# EasyEDA Pro project 外部.eprj

# Schematic Schematic1
Create Date: 2024-06-12; Page Name: P1; Project Name: 外部; Schematic Name: Schematic1; Update Date: 2024-06-14; Company: 嘉立创EDA; Page Size: A4; Version: V1.0
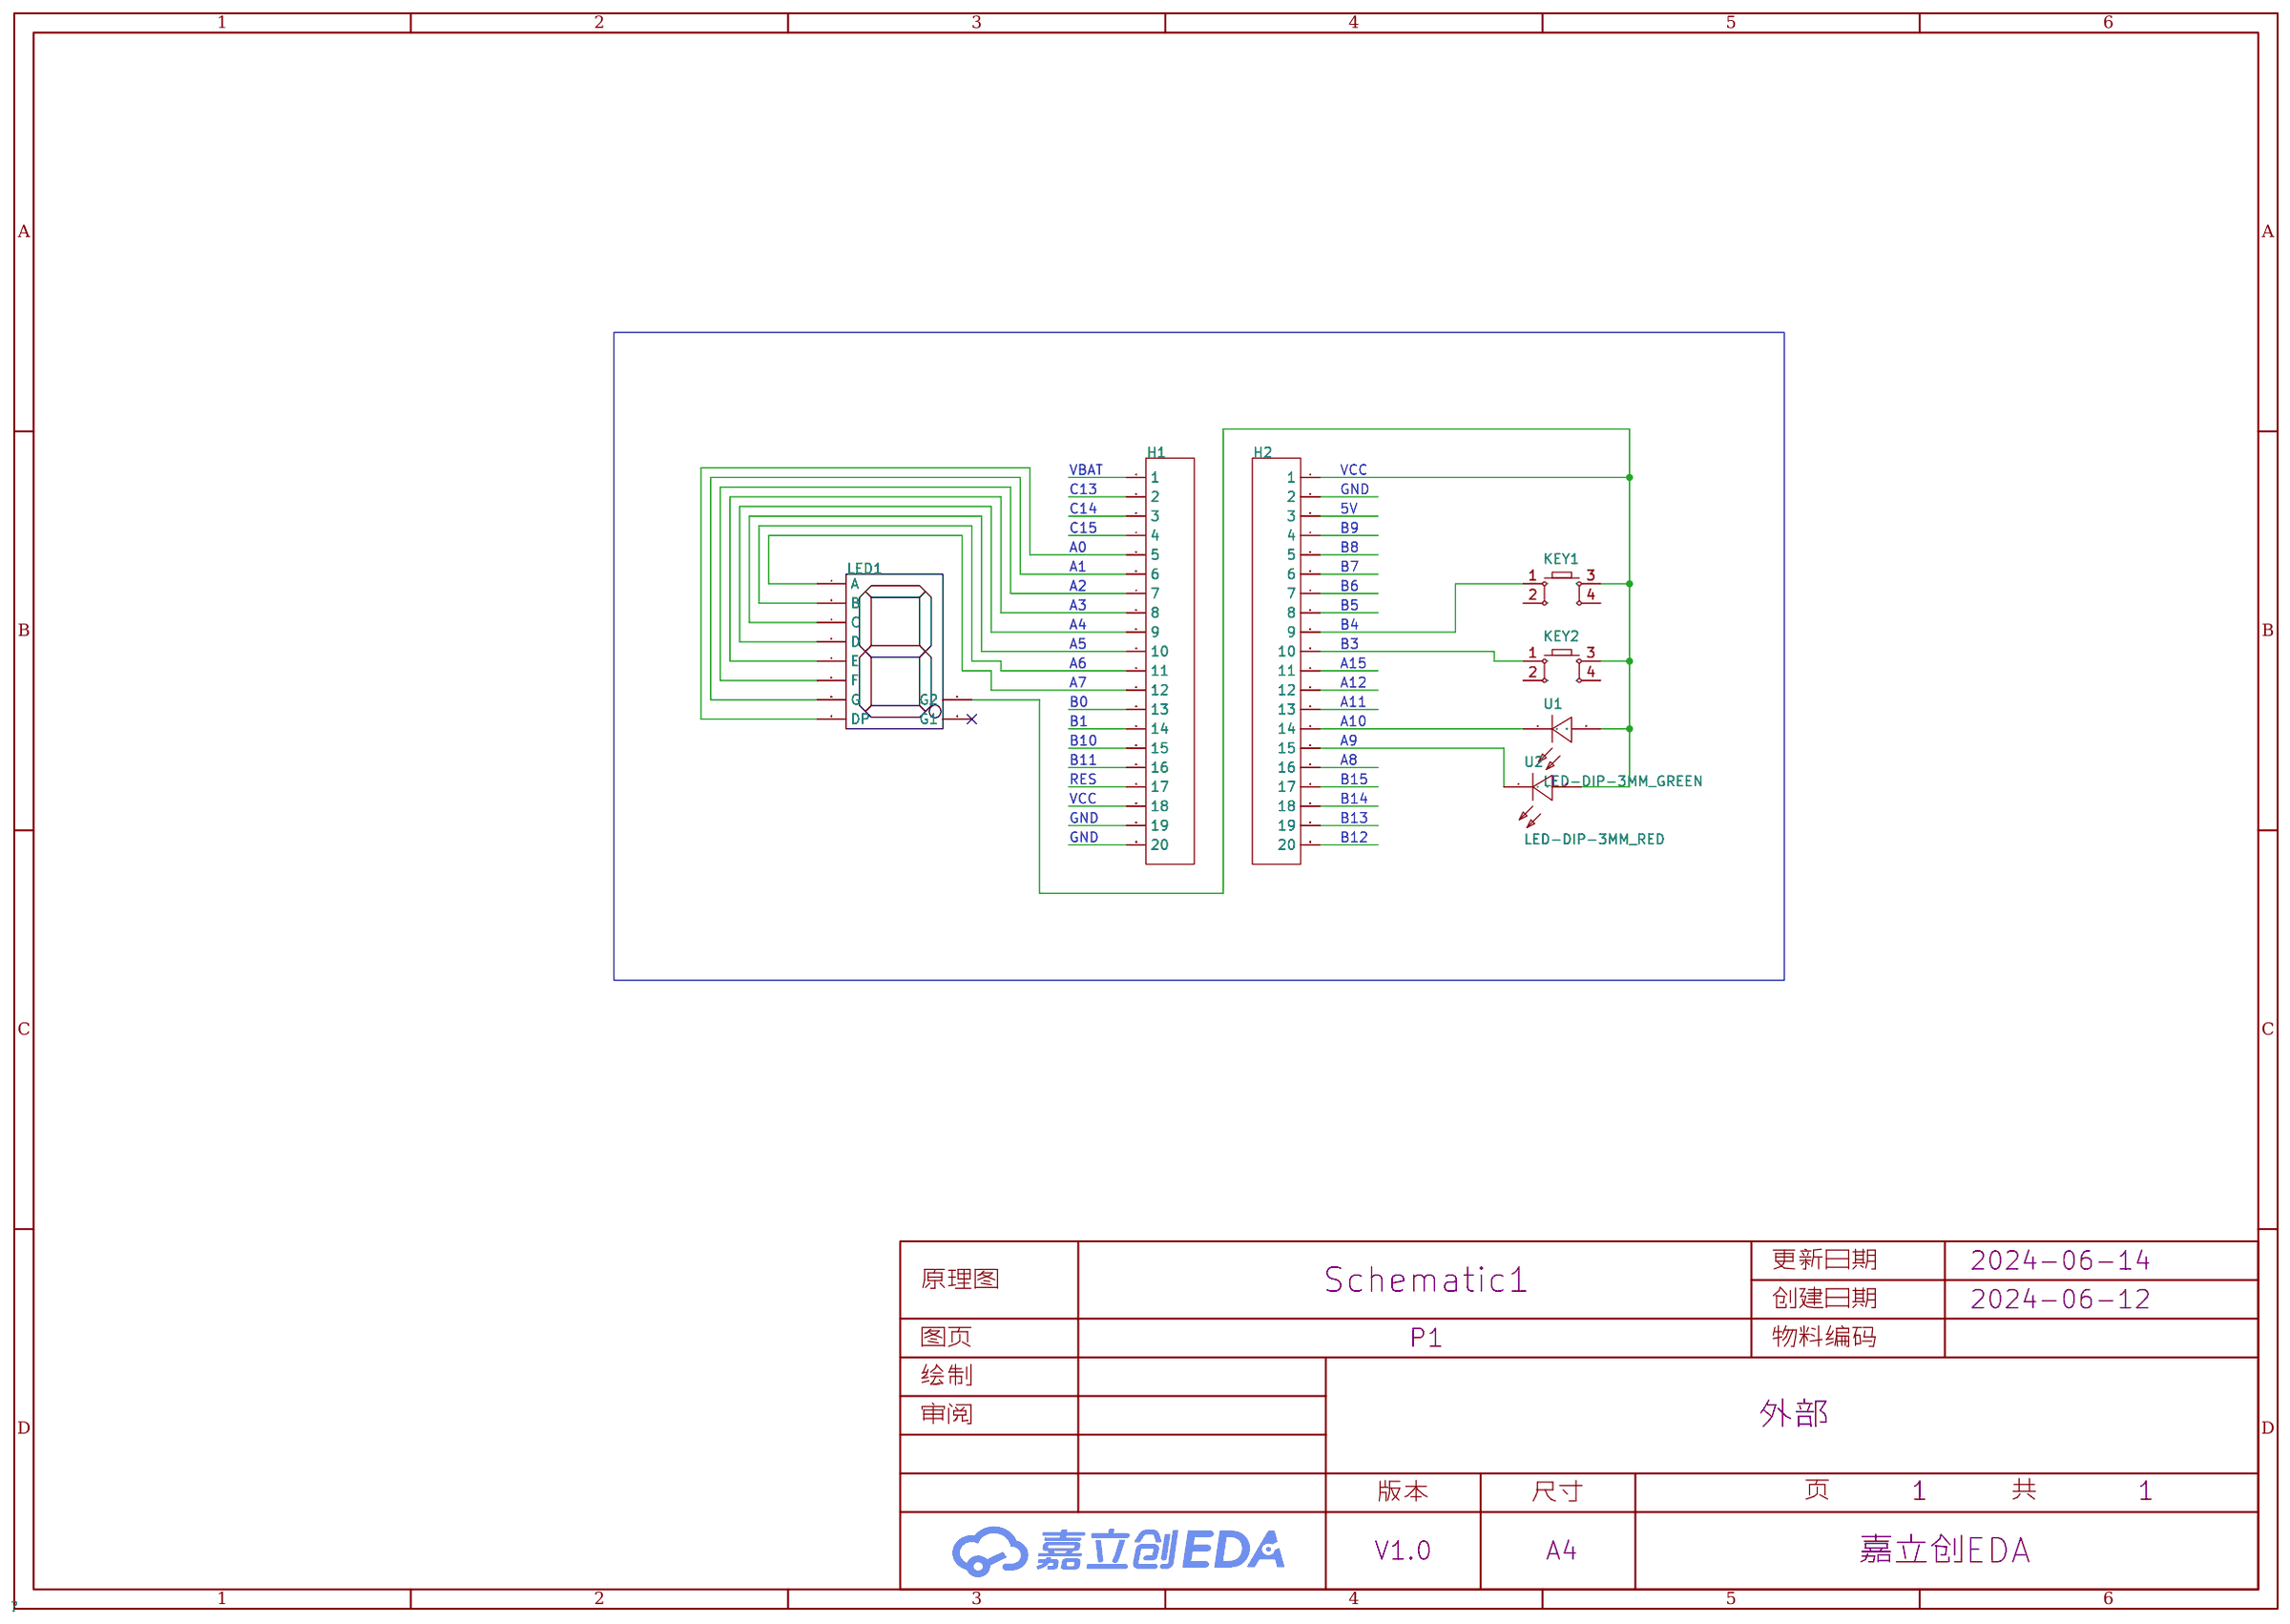
[diagram p0: schematic sheet]

## Parts
H1  -  [HDR-TH_20P-P2.54-V-F]
H2  -  [HDR-TH_20P-P2.54-V-F]
KEY1  -  [Key_SMD_12x12x7.3]
KEY2  -  [Key_SMD_12x12x7.3]
LED1  -  [LED-SEG-TH_10P-L12.6-W19.0-P2.54-S15.24-BL]
U1  LED-DIP-3MM_GREEN  [LED-TH_BD4.0-P2.00-D0.5-RD_BULE]
U2  LED-DIP-3MM_RED  [LED-TH_BD4.0-P2.00-D0.5-RD_BULE]

## Library data of the parts
H1 H2 = HDR-F_2.54_1x20P: Supplier Part: C50984; Supplier Footprint: 插件
KEY1 KEY2 = Key_SMD_12x12x7.3: Supplier Footprint: SMD
LED1 = LED_SEG_TH_0.56x1: Supplier Footprint: 插件
U1 U2 = LED-DIP-3MM_Blue: Supplier Part: C9900002363; Supplier Footprint: LED-TH_BD4.1-P2.00; JLCPCB Part Class: 扩展库; Supplier: LCSC

## Nets
$1N320: H1.6 LED1.10(G)
$1N324: H1.7 LED1.9(F)
$1N328: H1.8 LED1.1(E)
$1N332: H1.9 LED1.2(D)
$1N336: H1.10 LED1.4(C)
$1N340: H1.11 LED1.6(B)
$1N344: H1.12 LED1.7(A)
$1N418: H2.10 KEY2.1
$1N434: H2.14 U1.1
$1N438: H2.15 U2.1
$1N1407: H1.5 LED1.5(DP)
$1N1926: H2.9 KEY1.1
$1N2233: H2.1 KEY1.3 KEY2.3 LED1.8(G2) U1.2 U2.2

Not connected (* = marked no-connect by the designer): H1 1 2 3 4 13 14 15 16 17 18 19 20; H2 2 3 4 5 6 7 8 11 12 13 16 17 18 19 20; KEY1 2 4; KEY2 2 4; LED1 3(G1)*

## Notes on the sheet
- VBAT
- VCC
- C13
- GND
- C14
- 5V
- C15
- B9
- A0
- B8
- A1
- A2
- B6
- B7
- A3
- B5
- A4
- B4
- A5
- B3
- A6
- A15
- A7
- B0
- A11
- A12
- B1
- A10
- B10
- A9
- B11
- A8
- RES
- B15
- VCC
- B14
- GND
- GND
- B12
- B13

# Board PCB1
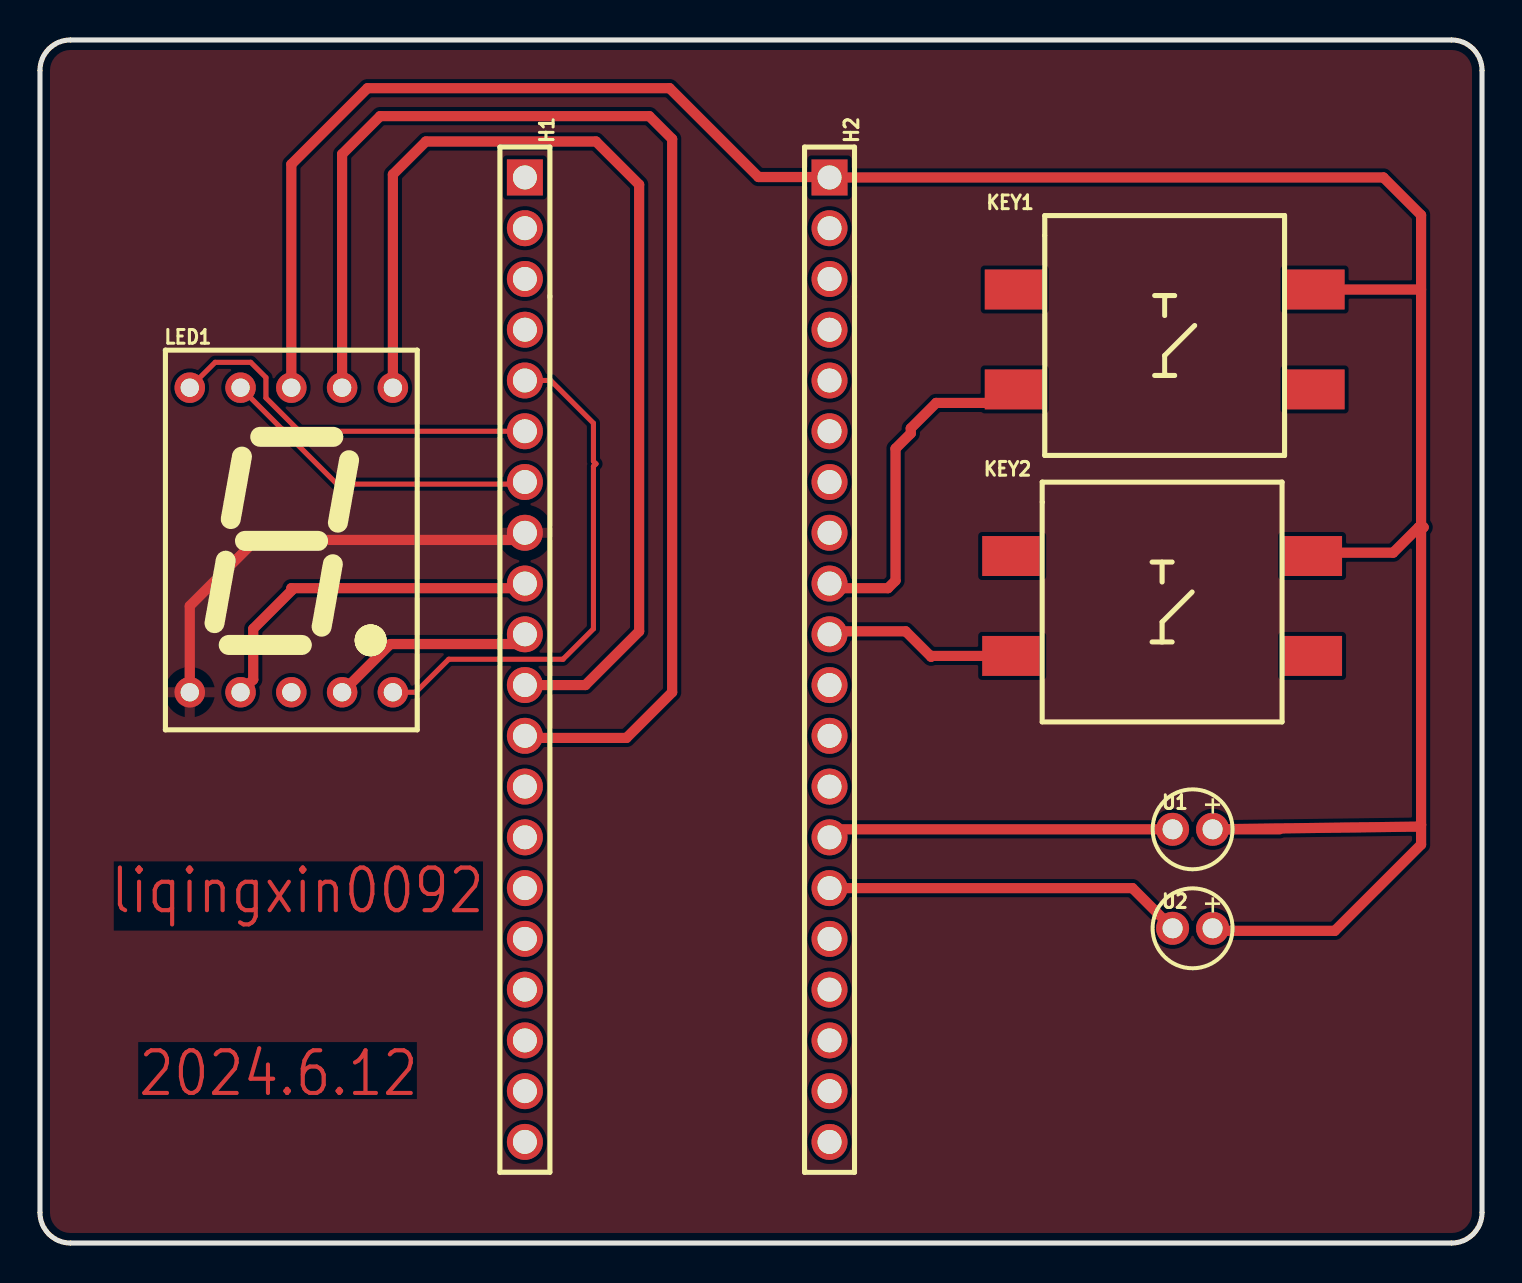
[diagram p1: board, top side]
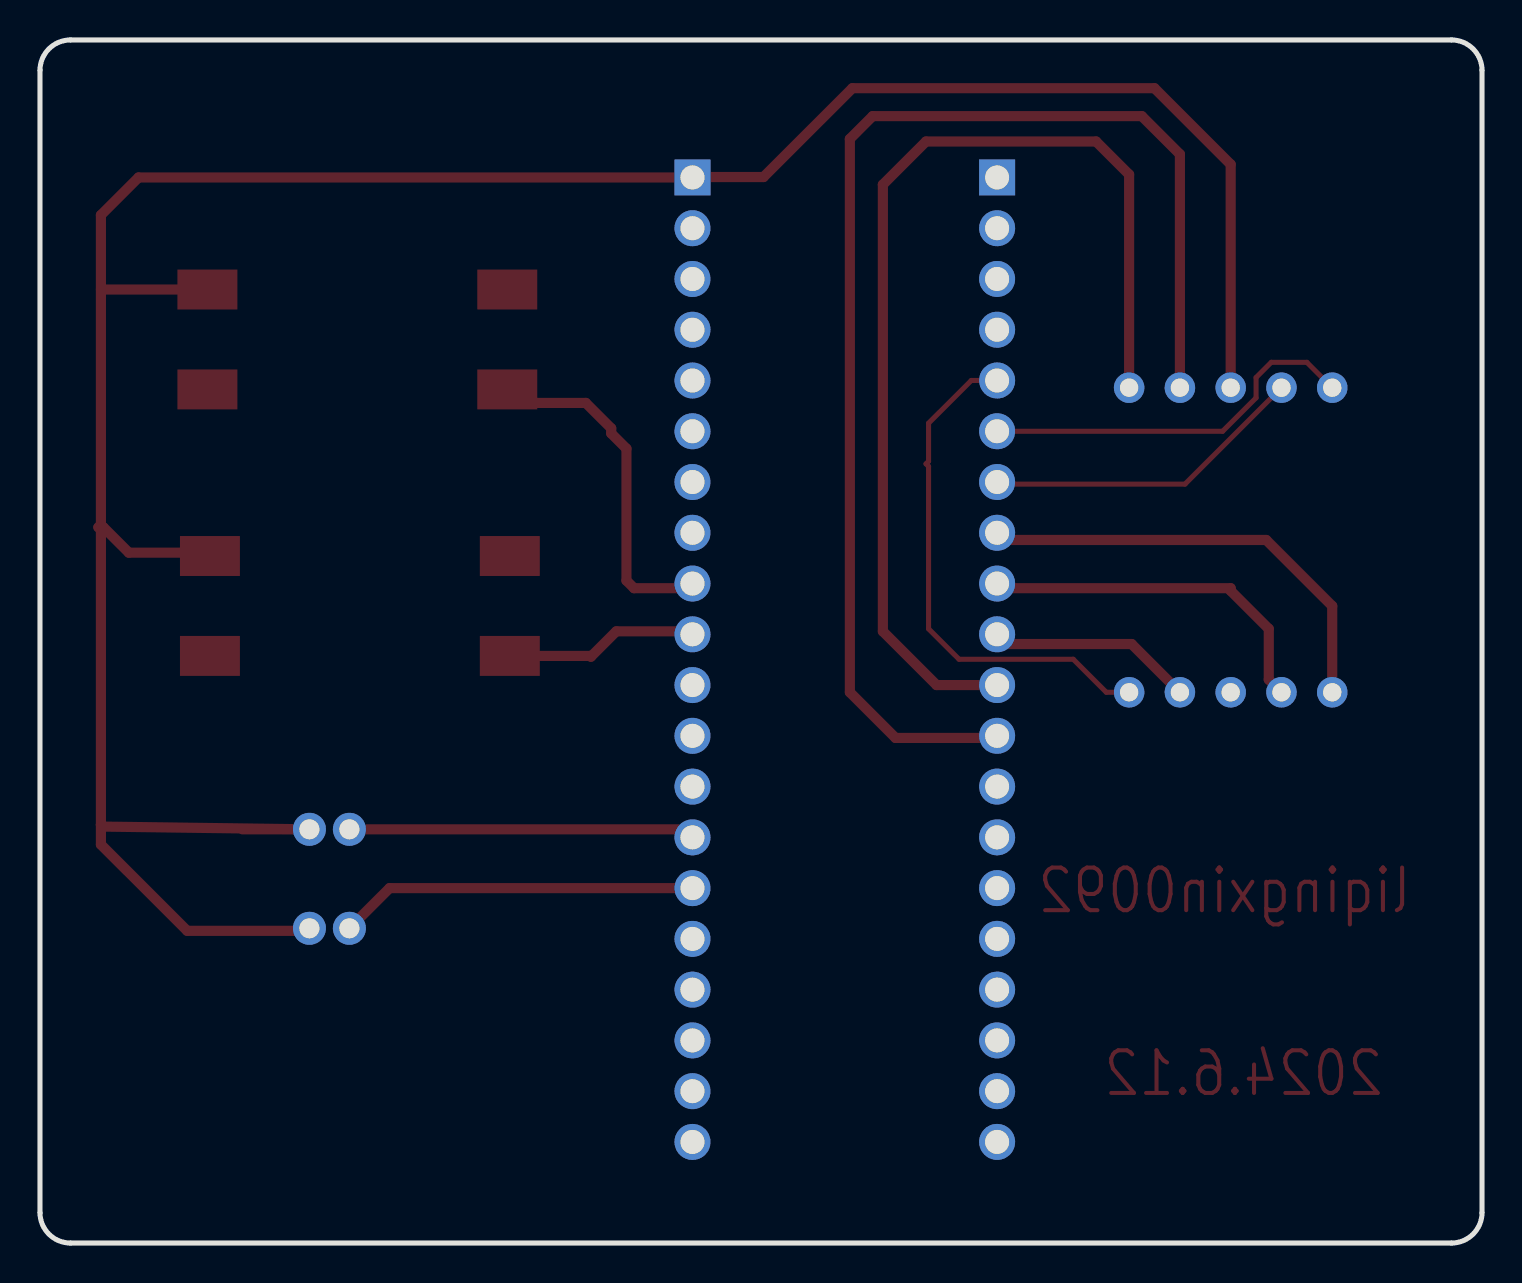
[diagram p2: board, bottom side, seen from below]

Outline 72.14 x 60.2 mm; copper layers: Top Layer, Bottom Layer. Coordinates in mm from the lower left corner of the outline.
Outline path: 0,58.67 0,1.52 arc(0.45,0.45) 1.52,0 70.61,0 arc(71.69,0.45) 72.14,1.52 72.14,58.67 arc(71.69,59.75) 70.61,60.2 1.52,60.2 arc(0.45,59.75) 0,58.67
Stack: Top Layer 0.035mm / Dielectric1 1.51mm FR4 er 4.5 / Bottom Layer 0.035mm

## Design rules (mm)
template: JLCPCB Capability(Two Layers Board)
spacing copperThickness1oz (default): track to track 0.102, other pairs 0.152 to 0.3
spacing copperThickness2oz: track to track 0.203, other pairs 0.152 to 0.3
track width copperThickness1oz (default): min 0.127, default 0.254, max 2.54
track width copperThickness2oz: min 0.203, default 0.254, max 2.54
differential pair differentialPair (default): width min 0.127, default 0.254, max 2.54; gap min 0.152, default 0.152
via viaSize (default): diameter min 0.5, default 0.61, max 10; hole min 0.3, default 0.305, max 6.3

## Placement (name value [footprint] x y rotation side)
H1  -  [HDR-TH_20P-P2.54-V-F]  24.26 29.19 270 top
H2  -  [HDR-TH_20P-P2.54-V-F]  39.5 29.19 270 top
KEY1  -  [Key_SMD_12x12x7.3]  56.26 45.21 0 top
KEY2  -  [Key_SMD_12x12x7.3]  56.13 31.88 0 top
LED1  -  [LED-SEG-TH_10P-L12.6-W19.0-P2.54-S15.24-BL]  12.57 35.18 0 top
U1  LED-DIP-3MM_GREEN  [LED-TH_BD4.0-P2.00-D0.5-RD_BULE]  57.66 20.7 0 top
U2  LED-DIP-3MM_RED  [LED-TH_BD4.0-P2.00-D0.5-RD_BULE]  57.66 15.75 0 top

## Footprints (pads in the part's own frame, mm; a bottom-side part is the same pattern mirrored in y, then rotated)
HDR-TH_20P-P2.54-V-F
  rect 1.8x1.8 hole 1.2: 1(-24.13,0)
  round 1.8 hole 1.2: 2(-21.59,0) 3(-19.05,0) 4(-16.51,0) 5(-13.97,0) 6(-11.43,0) 7(-8.89,0) 8(-6.35,0) 9(-3.81,0) 10(-1.27,0) 11(1.27,0) 12(3.81,0) 13(6.35,0) 14(8.89,0) 15(11.43,0) 16(13.97,0) 17(16.51,0) 18(19.05,0) 19(21.59,0) 20(24.13,0)
Key_SMD_12x12x7.3
  rect 2.999x1.999 smd: 1(-7.5,-2.499) 2(7.5,-2.499) 3(7.5,2.499) 4(-7.5,2.499)
LED-SEG-TH_10P-L12.6-W19.0-P2.54-S15.24-BL
  round 1.524 hole 0.914: 1(-5.08,-7.62) 2(-2.54,-7.62) 3(0,-7.62) 4(2.54,-7.62) 5(5.08,-7.62) 6(5.08,7.62) 7(2.54,7.62) 8(0,7.62) 9(-2.54,7.62) 10(-5.08,7.62)
LED-TH_BD4.0-P2.00-D0.5-RD_BULE
  round 1.65 hole 1: 1(-1,0) 2(1,0)

## Nets
As in the schematic.

Pads without a net: H1 18; KEY1 2 4; KEY2 2 4; LED1 3

## Routing (per net, layer and track width the routed paths; a pad name or vN(x,y) marks a point on that pad's centre or on a via; arc(x,y) is an arc through that point)
$1N320: length 19.3
  Top Layer w0.254: H1.6 12.97,40.62 11.3,42.29 11.3,43.31 10.54,44.07 8.76,44.07 LED1.10
$1N324: length 16.3
  Top Layer w0.254: H1.7 24.15,37.97 14.86,37.97 LED1.9
$1N328: length 22.6
  Top Layer w0.508: H1.8 23.9,35.18 10.8,35.18 7.49,31.88 LED1.1
$1N332: length 18
  Top Layer w0.508: LED1.2 10.67,28.19 10.67,30.73 12.57,32.64 12.57,32.77 24.02,32.77 H1.9
$1N336: length 10.3
  Top Layer w0.508: H1.10 23.77,29.97 17.53,29.97 LED1.4
$1N340: length 53.7
  Top Layer w0.508: H1.11 27.28,27.92 29.97,30.61 29.97,52.96 27.81,55.12 19.3,55.12 17.65,53.47 LED1.6
$1N344: length 65.5
  Top Layer w0.508: H1.12 24.36,25.27 29.34,25.27 31.62,27.56 31.62,55.24 30.48,56.39 17.02,56.39 15.11,54.48 LED1.7
$1N418: length 9.7
  Top Layer w0.508: H2.10 39.64,30.61 43.31,30.61 44.58,29.34 44.62,29.38 KEY2.1
$1N434: length 17.3
  Top Layer w0.508: H2.14 39.9,20.7 U1.1
$1N438: length 18
  Top Layer w0.508: H2.15 54.65,17.76 U2.1
$1N1407: length 26.1
  Top Layer w0.254: H1.5 25.55,43.16 27.69,41.02 27.69,39.12 27.81,38.99 27.69,38.86 27.69,30.73 26.16,29.21 20.45,29.21 18.8,27.56 LED1.5
$1N1926: length 17.5
  Top Layer w0.508: H2.9 39.73,32.77 42.42,32.77 42.8,33.15 42.8,39.75 43.56,40.51 43.56,40.77 44.83,42.04 48.08,42.04 KEY1.1
$1N2233: length 141
  Top Layer w0.508: 69.09,35.81 69.09,20.93 ; 69.09,35.81 69.21,35.81 69.09,35.94 69.09,51.44 67.2,53.32 H2.1 39.47,53.34 35.94,53.34 31.5,57.78 16.38,57.78 12.57,53.97 LED1.8 ; 69.09,35.81 68.96,35.81 67.69,34.54 63.8,34.54 KEY2.3 ; 69.09,20.93 69,20.84 U1.2 62.01,20.7 ; 69.09,20.93 69.09,19.94 64.77,15.62 58.78,15.62 U2.2 ; KEY1.3 69.09,47.71

## Copper pours and planes (outline as drawn; the poured copper is in the pictures)
$1N328 on Top Layer: -2.54,64.01 74.68,64.01 74.68,-2.67 -2.54,-2.67

## Text on the board
Top Layer: liqingxin0092 | 2024.6.12
